# Altium schematic sheet System_Diagram.SchDoc
size A; SheetNumber: 1; SheetTotal: 2
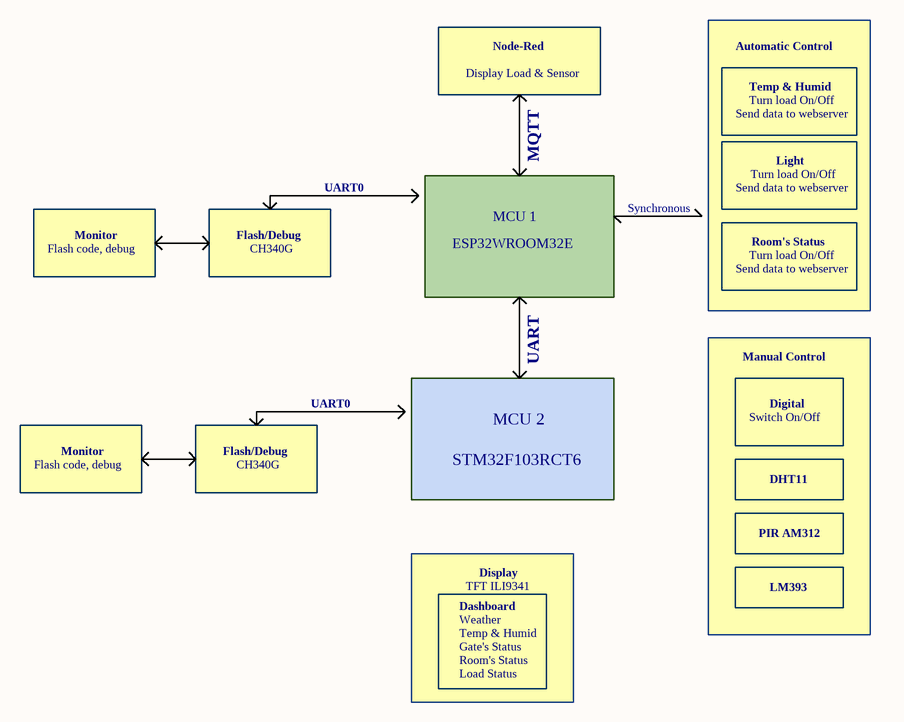
[diagram p0: System_Diagram.SchDoc]

## Notes on the sheet
- Display Load & Sensor
- Node-Red
- Automatic Control
- Temp & Humid
- MQTT
- Send data to webserver
- Turn load On/Off
- Light
- UART0
- MCU 1
- Synchronous
- Flash code, debug
- Monitor
- Flash/Debug
- CH340G
- ESP32WROOM32E
- Room's Status
- UART
- Manual Control
- MCU 2
- Switch On/Off
- Digital
- STM32F103RCT6
- DHT11
- PIR AM312
- Dashboard
- Weather
- TFT ILI9341
- Display
- LM393
- Gate's Status
- Load Status